# Altium schematic sheet InputChannel.SchDoc
size A4
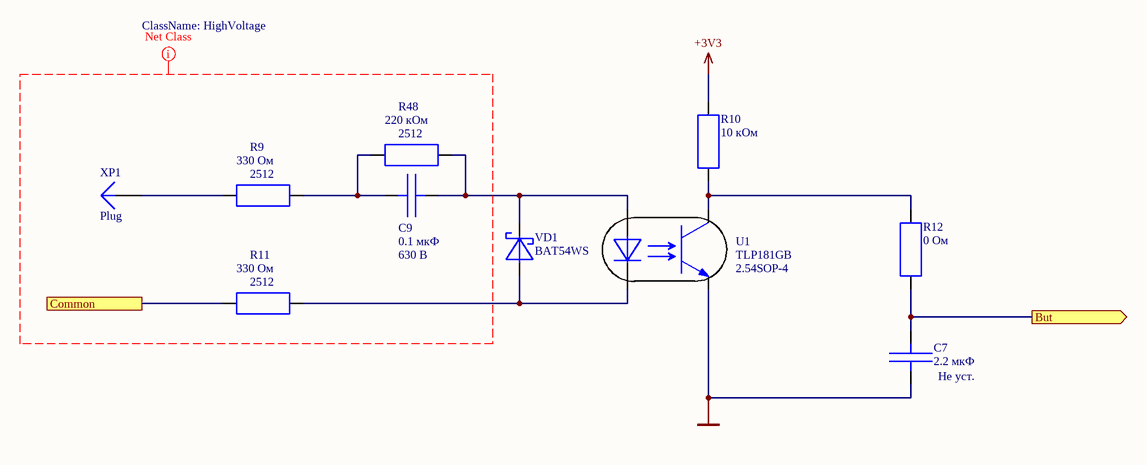
[diagram p0: InputChannel.SchDoc]

## Parts
C7  Не уст.  value 2.2 мкФ  [CAP_0603-1608]  (no BOM)
C9  value 0.1 мкФ  Voltage: 630 В  [CAP_1812-4532]  (hidden comment: Cap)
R9  value 330 Ом  Case: 2512  [RES_2512-6332]  (hidden comment: Res)
R10  value 10 кОм  [RES_0603-1608]  (hidden comment: Res)
R11  value 330 Ом  Case: 2512  [RES_2512-6332]  (hidden comment: Res)
R12  value 0 Ом  [RES_0603-1608]  (hidden comment: Res)
R48  value 220 кОм  Case: 2512  [RES_2512-6332]  (hidden comment: Res)
U1  Case: 2.54SOP-4  Type: TLP181GB  [SOP-2.54-4]  (hidden comment: OptoIso_Trans)
VD1  Type: BAT54WS  [SOD-323]  (hidden comment: Diode_Schottky)
XP1  Plug  [EK508V_Pin]  (no BOM)

## Ports
But (out), Common

## Nets
+3V3: R10.2
GND: C7.1 U1.3(E)
But: C7.2 R12.1 ; port But
Common: R11.1 ; port Common
NetC9_1: C9.1 R48.2 U1.1(A) VD1.2(K)
NetC9_2: C9.2 R9.2 R48.1
NetR9_1: R9.1 XP1.1
NetR10_1: R10.1 R12.2 U1.4(C)
NetR11_2: R11.2 U1.2(K) VD1.1(A)

## Layout directives
net class HighVoltage: (no net found under the mark)

## Library data of the parts
C7 = Cap: Конденсатор; Voltage: 6.3 В; Dielectric: X7R; BomGroup: Конденсаторы; BomTitle: Конденсатор керамический SMD; Case: 0603
C9 = Cap: Конденсатор; Type: GRM43DR72J104K; Dielectric: X7R; BomGroup: Конденсаторы; BomTitle: Конденсатор керамический SMD; Case: 1812
R9-R12 R48 = Res: Резистор постоянный; Tolerance: 5%; BomGroup: Резисторы; BomTitle: Резистор SMD
  R10: Power: *; Case: 0603; Type: *
  R12: Case: 0603
U1 = OptoIso_Trans: Оптопара транзисторная; BomGroup: Оптоэлектронные приборы; BomTitle: Оптопара транзисторная
VD1 = Diode_Schottky: Диод Шоттки; BomGroup: Диоды; Case: SOD-323; BomTitle: Диод Шоттки
XP1 = Plug: LatestRevisionDate: 17-Jul-2002; LatestRevisionNote: Re-released for DXP Platform.; Publisher: Altium Limited